# Altium schematic sheet TMS320F28335_DSP.SchDoc
size C
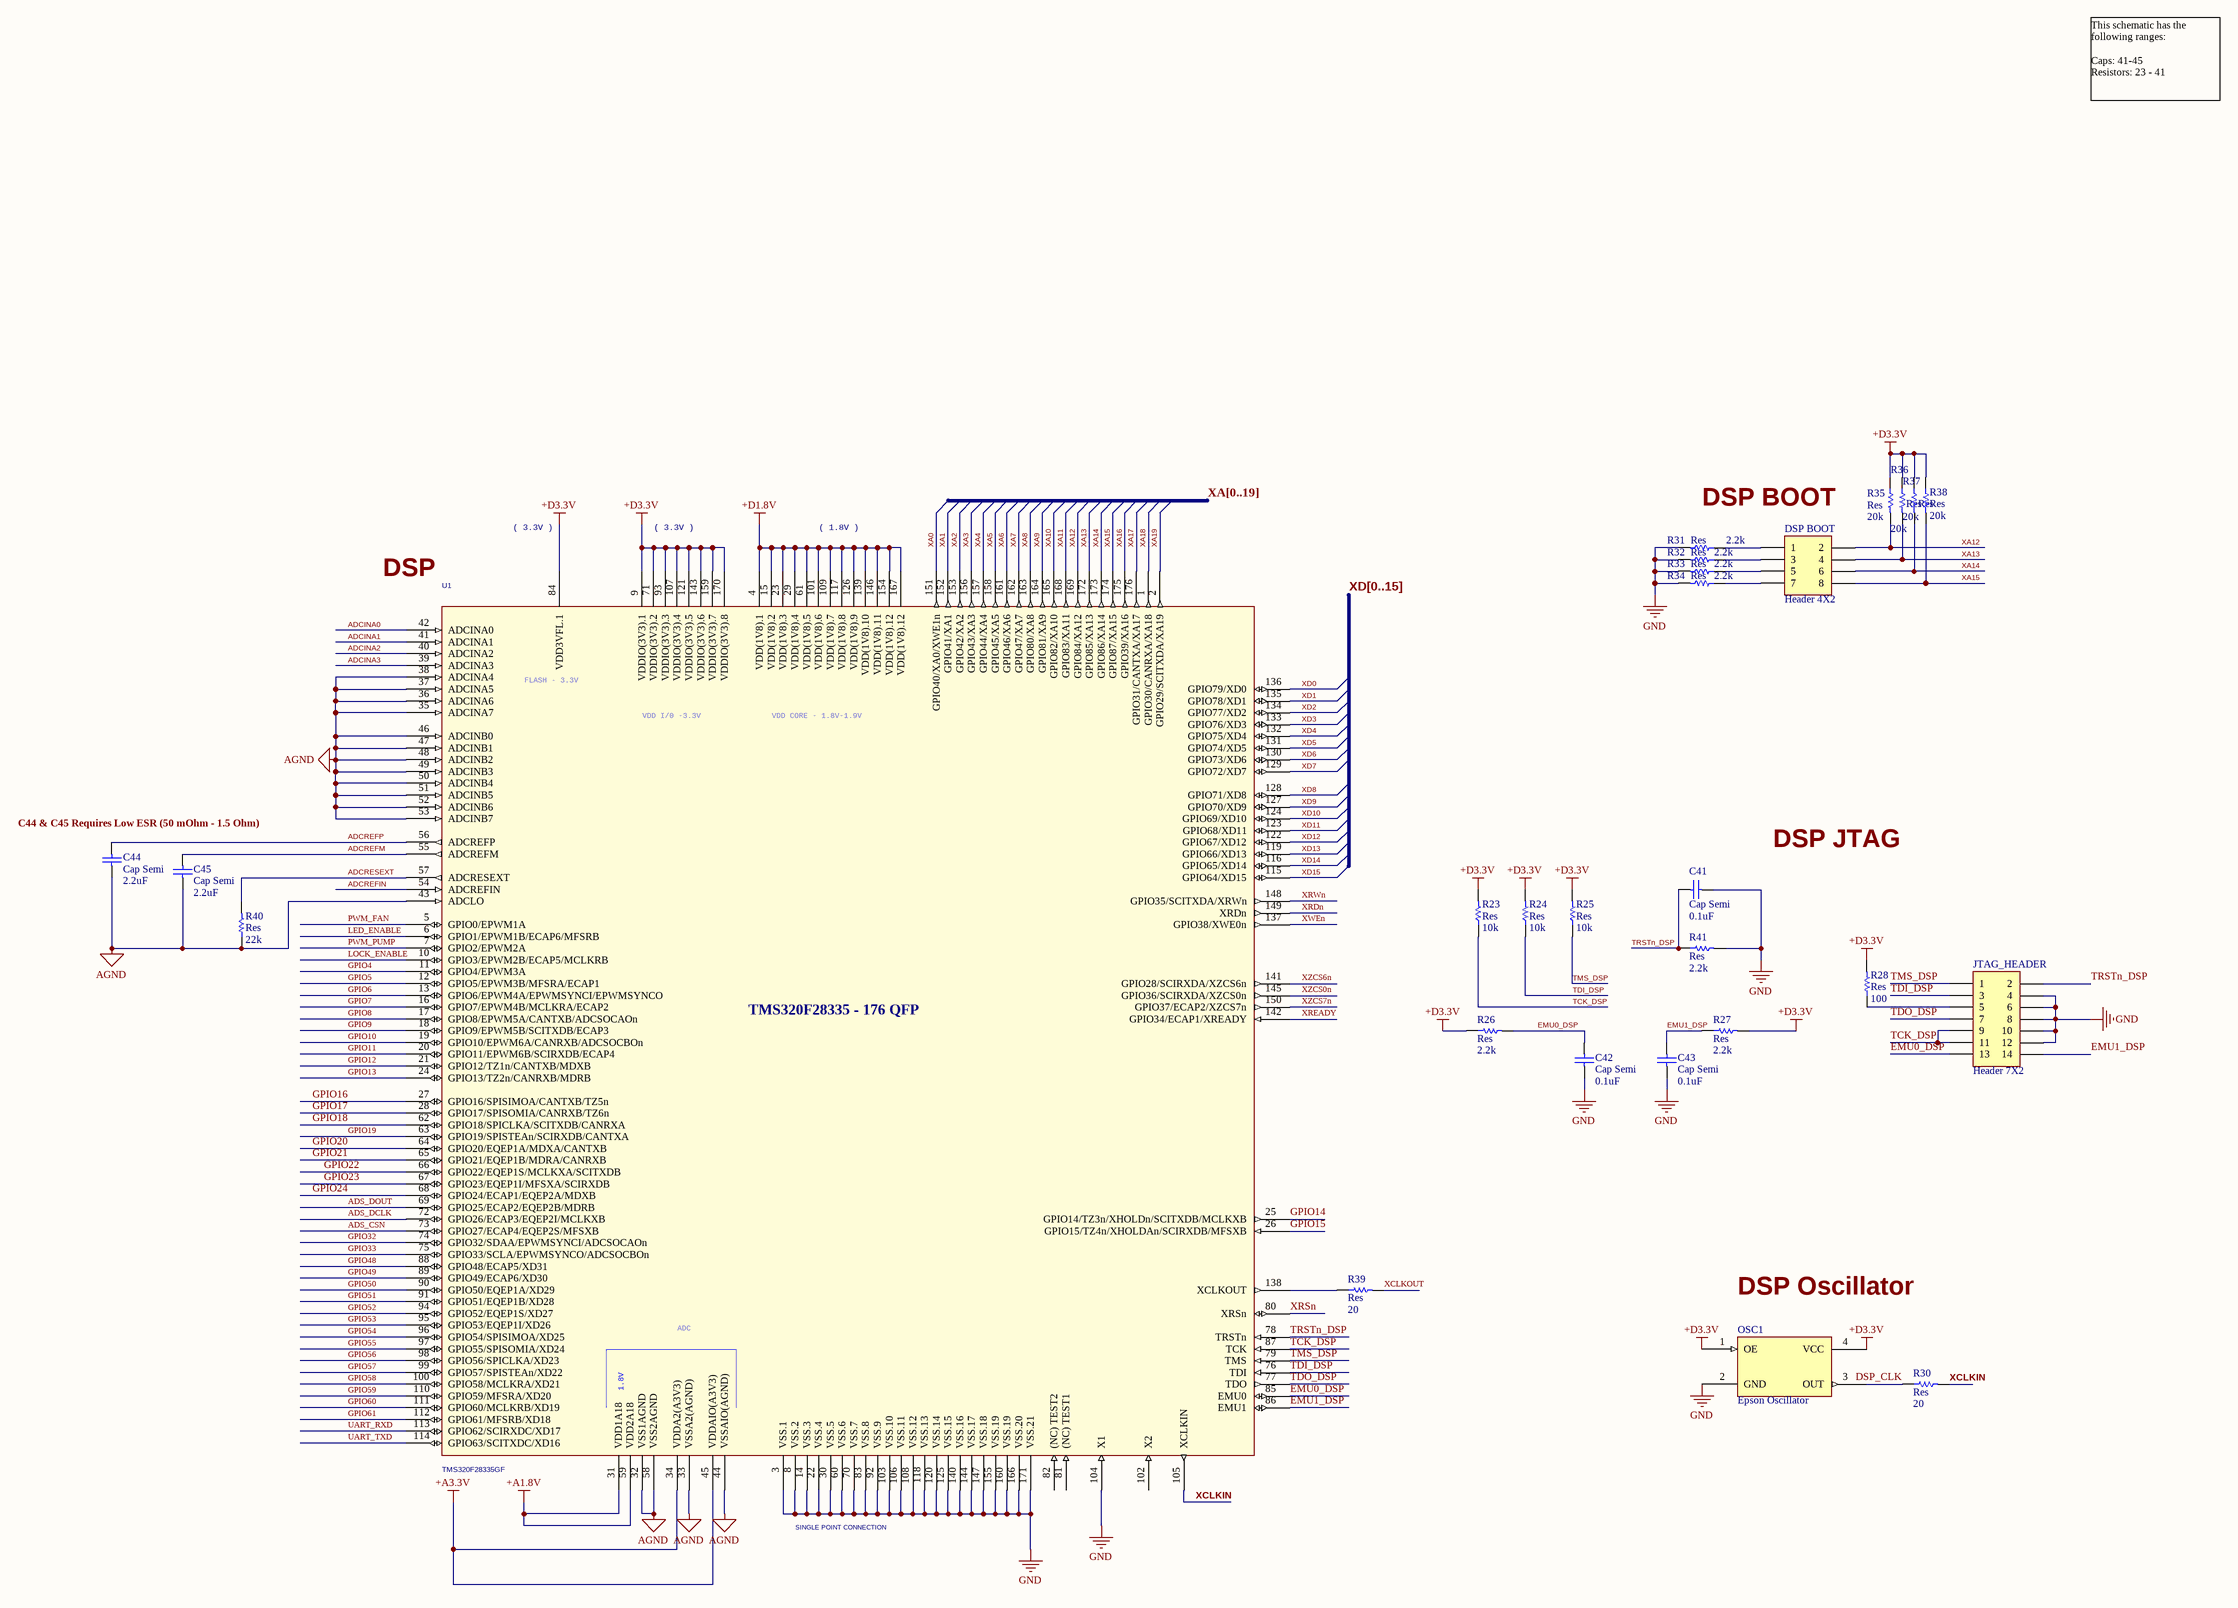
[diagram p0: TMS320F28335_DSP.SchDoc]

## Parts
C41  Cap Semi  value 0.1uF  [0805]
C42  Cap Semi  value 0.1uF  [0805]
C43  Cap Semi  value 0.1uF  [0805]
C44  Cap Semi  value 2.2uF  [0805]
C45  Cap Semi  value 2.2uF  [0805]
DSP_BOOT  Header 4X2  [HDR2X4]
JTAG_HEADER  Header 7X2  [HDR2X7]
OSC1  Epson Oscillator  [Oscillator]
R23  Res  value 10k  [0805]
R24  Res  value 10k  [0805]
R25  Res  value 10k  [0805]
R26  Res  value 2.2k  [0805]
R27  Res  value 2.2k  [0805]
R28  Res  value 100  [0805]
R30  Res  value 20  [0805]
R31  Res  value 2.2k  [0805]
R32  Res  value 2.2k  [0805]
R33  Res  value 2.2k  [0805]
R34  Res  value 2.2k  [0805]
R35  Res  value 20k  [0805]
R36  Res  value 20k  [0805]
R37  Res  value 20k  [0805]
R38  Res  value 20k  [0805]
R39  Res  value 20  [0805]
R40  Res  value 22k  [0805]
R41  Res  value 2.2k  [0805]
U1  TMS320F28335GF  [QFP176]

## Nets
+A1.8V: U1.31(VDD1A18) U1.59(VDD2A18)
+A3.3V: U1.34(VDDA2(A3V3)) U1.45(VDDAIO(A3V3))
+D1.8V: U1.4(VDD(1V8).1) U1.15(VDD(1V8).2) U1.23(VDD(1V8).3) U1.29(VDD(1V8).4) U1.61(VDD(1V8).5) U1.101(VDD(1V8).6) U1.109(VDD(1V8).7) U1.117(VDD(1V8).8) U1.126(VDD(1V8).9) U1.139(VDD(1V8).10) U1.146(VDD(1V8).11) U1.154(VDD(1V8).12) U1.167(VDD(1V8).12)
+D3.3V: OSC1.1(OE) OSC1.4(VCC) R23.2 R24.2 R25.2 R26.1 R27.2 R28.2 R35.1 R36.1 R37.1 R38.1 U1.9(VDDIO(3V3).1) U1.71(VDDIO(3V3).2) U1.84(VDD3VFL.1) U1.93(VDDIO(3V3).3) U1.107(VDDIO(3V3).4) U1.121(VDDIO(3V3).5) U1.143(VDDIO(3V3).6) U1.159(VDDIO(3V3).7) U1.170(VDDIO(3V3).8)
AGND: C44.2 C45.2 R40.1 U1.32(VSS1AGND) U1.33(VSSA2(AGND)) U1.35(ADCINA7) U1.36(ADCINA6) U1.37(ADCINA5) U1.38(ADCINA4) U1.43(ADCLO) U1.44(VSSAIO(AGND)) U1.46(ADCINB0) U1.47(ADCINB1) U1.48(ADCINB2) U1.49(ADCINB3) U1.50(ADCINB4) U1.51(ADCINB5) U1.52(ADCINB6) U1.53(ADCINB7) U1.58(VSS2AGND)
GND: C41.1 C42.1 C43.1 JTAG_HEADER.4 JTAG_HEADER.6 JTAG_HEADER.8 JTAG_HEADER.10 JTAG_HEADER.12 OSC1.2(GND) R31.2 R32.2 R33.2 R34.2 R41.2 U1.3(VSS.1) U1.8(VSS.2) U1.14(VSS.3) U1.22(VSS.4) U1.30(VSS.5) U1.60(VSS.6) U1.70(VSS.7) U1.83(VSS.8) U1.92(VSS.9) U1.103(VSS.10) U1.104(X1) U1.106(VSS.11) U1.108(VSS.12) U1.118(VSS.13) U1.120(VSS.14) U1.125(VSS.15) U1.140(VSS.16) U1.144(VSS.17) U1.147(VSS.18) U1.155(VSS.19) U1.160(VSS.19) U1.166(VSS.20) U1.171(VSS.21)
ADCINA0: U1.42(ADCINA0)
ADCINA1: U1.41(ADCINA1)
ADCINA2: U1.40(ADCINA2)
ADCINA3: U1.39(ADCINA3)
ADCREFIN: U1.54(ADCREFIN)
ADCREFM: C45.1 U1.55(ADCREFM)
ADCREFP: C44.1 U1.56(ADCREFP)
ADCRESEXT: R40.2 U1.57(ADCRESEXT)
ADS_CSN: U1.73(GPIO27/ECAP4/EQEP2S/MFSXB)
ADS_DCLK: U1.72(GPIO26/ECAP3/EQEP2I/MCLKXB)
ADS_DOUT: U1.69(GPIO25/ECAP2/EQEP2B/MDRB)
EMU0_DSP: C42.2 JTAG_HEADER.13 R26.2 U1.85(EMU0)
EMU1_DSP: C43.2 JTAG_HEADER.14 R27.1 U1.86(EMU1)
GPIO4: U1.11(GPIO4/EPWM3A)
GPIO5: U1.12(GPIO5/EPWM3B/MFSRA/ECAP1)
GPIO6: U1.13(GPIO6/EPWM4A/EPWMSYNCI/EPWMSYNCO)
GPIO7: U1.16(GPIO7/EPWM4B/MCLKRA/ECAP2)
GPIO8: U1.17(GPIO8/EPWM5A/CANTXB/ADCSOCAOn)
GPIO9: U1.18(GPIO9/EPWM5B/SCITXDB/ECAP3)
GPIO10: U1.19(GPIO10/EPWM6A/CANRXB/ADCSOCBOn)
GPIO11: U1.20(GPIO11/EPWM6B/SCIRXDB/ECAP4)
GPIO12: U1.21(GPIO12/TZ1n/CANTXB/MDXB)
GPIO13: U1.24(GPIO13/TZ2n/CANRXB/MDRB)
GPIO14: U1.25(GPIO14/TZ3n/XHOLDn/SCITXDB/MCLKXB)
GPIO15: U1.26(GPIO15/TZ4n/XHOLDAn/SCIRXDB/MFSXB)
GPIO16: U1.27(GPIO16/SPISIMOA/CANTXB/TZ5n)
GPIO17: U1.28(GPIO17/SPISOMIA/CANRXB/TZ6n)
GPIO18: U1.62(GPIO18/SPICLKA/SCITXDB/CANRXA)
GPIO19: U1.63(GPIO19/SPISTEAn/SCIRXDB/CANTXA)
GPIO20: U1.64(GPIO20/EQEP1A/MDXA/CANTXB)
GPIO21: U1.65(GPIO21/EQEP1B/MDRA/CANRXB)
GPIO22: U1.66(GPIO22/EQEP1S/MCLKXA/SCITXDB)
GPIO23: U1.67(GPIO23/EQEP1I/MFSXA/SCIRXDB)
GPIO24: U1.68(GPIO24/ECAP1/EQEP2A/MDXB)
GPIO32: U1.74(GPIO32/SDAA/EPWMSYNCI/ADCSOCAOn)
GPIO33: U1.75(GPIO33/SCLA/EPWMSYNCO/ADCSOCBOn)
GPIO48: U1.88(GPIO48/ECAP5/XD31)
GPIO49: U1.89(GPIO49/ECAP6/XD30)
GPIO50: U1.90(GPIO50/EQEP1A/XD29)
GPIO51: U1.91(GPIO51/EQEP1B/XD28)
GPIO52: U1.94(GPIO52/EQEP1S/XD27)
GPIO53: U1.95(GPIO53/EQEP1I/XD26)
GPIO54: U1.96(GPIO54/SPISIMOA/XD25)
GPIO55: U1.97(GPIO55/SPISOMIA/XD24)
GPIO56: U1.98(GPIO56/SPICLKA/XD23)
GPIO57: U1.99(GPIO57/SPISTEAn/XD22)
GPIO58: U1.100(GPIO58/MCLKRA/XD21)
GPIO59: U1.110(GPIO59/MFSRA/XD20)
GPIO60: U1.111(GPIO60/MCLKRB/XD19)
GPIO61: U1.112(GPIO61/MFSRB/XD18)
LED_ENABLE: U1.6(GPIO1/EPWM1B/ECAP6/MFSRB)
LOCK_ENABLE: U1.10(GPIO3/EPWM2B/ECAP5/MCLKRB)
PWM_FAN: U1.5(GPIO0/EPWM1A)
PWM_PUMP: U1.7(GPIO2/EPWM2A)
TCK_DSP: JTAG_HEADER.9 JTAG_HEADER.11 R23.1 U1.87(TCK)
TDI_DSP: JTAG_HEADER.3 R24.1 U1.76(TDI)
TDO_DSP: JTAG_HEADER.7 U1.77(TDO)
TMS_DSP: JTAG_HEADER.1 R25.1 U1.79(TMS)
TRSTn_DSP: C41.2 JTAG_HEADER.2 R41.1 U1.78(TRSTn)
UART_RXD: U1.113(GPIO62/SCIRXDC/XD17)
UART_TXD: U1.114(GPIO63/SCITXDC/XD16)
XA0: U1.151(GPIO40/XA0/XWE1n)
XA1: U1.152(GPIO41/XA1)
XA2: U1.153(GPIO42/XA2)
XA3: U1.156(GPIO43/XA3)
XA4: U1.157(GPIO44/XA4)
XA5: U1.158(GPIO45/XA5)
XA6: U1.161(GPIO46/XA6)
XA7: U1.162(GPIO47/XA7)
XA8: U1.163(GPIO80/XA8)
XA9: U1.164(GPIO81/XA9)
XA10: U1.165(GPIO82/XA10)
XA11: U1.168(GPIO83/XA11)
XA12: DSP_BOOT.2 R35.2 U1.169(GPIO84/XA12)
XA13: DSP_BOOT.4 R36.2 U1.172(GPIO85/XA13)
XA14: DSP_BOOT.6 R37.2 U1.173(GPIO86/XA14)
XA15: DSP_BOOT.8 R38.2 U1.174(GPIO87/XA15)
XA16: U1.175(GPIO39/XA16)
XA17: U1.176(GPIO31/CANTXA/XA17)
XA18: U1.1(GPIO30/CANRXA/XA18)
XA19: U1.2(GPIO29/SCITXDA/XA19)
XCLKIN: R30.2 U1.105(XCLKIN)
XCLKOUT: R39.2
XD0: U1.136(GPIO79/XD0)
XD1: U1.135(GPIO78/XD1)
XD2: U1.134(GPIO77/XD2)
XD3: U1.133(GPIO76/XD3)
XD4: U1.132(GPIO75/XD4)
XD5: U1.131(GPIO74/XD5)
XD6: U1.130(GPIO73/XD6)
XD7: U1.129(GPIO72/XD7)
XD8: U1.128(GPIO71/XD8)
XD9: U1.127(GPIO70/XD9)
XD10: U1.124(GPIO69/XD10)
XD11: U1.123(GPIO68/XD11)
XD12: U1.122(GPIO67/XD12)
XD13: U1.119(GPIO66/XD13)
XD14: U1.116(GPIO65/XD14)
XD15: U1.115(GPIO64/XD15)
XRDn: U1.149(XRDn)
XREADY: U1.142(GPIO34/ECAP1/XREADY)
XRSn: U1.80(XRSn)
XRWn: U1.148(GPIO35/SCITXDA/XRWn)
XWEn: U1.137(GPIO38/XWE0n)
XZCS0n: U1.145(GPIO36/SCIRXDA/XZCS0n)
XZCS6n: U1.141(GPIO28/SCIRXDA/XZCS6n)
XZCS7n: U1.150(GPIO37/ECAP2/XZCS7n)
NetDSP_BOOT_1: DSP_BOOT.1 R31.1
NetDSP_BOOT_3: DSP_BOOT.3 R32.1
NetDSP_BOOT_5: DSP_BOOT.5 R33.1
NetDSP_BOOT_7: DSP_BOOT.7 R34.1
NetJTAG_HEADER_5: JTAG_HEADER.5 R28.1
NetOSC1_3: OSC1.3(OUT) R30.1
NetR39_1: R39.1 U1.138(XCLKOUT)

Not connected (* = marked no-connect by the designer): U1 81((NC)_TEST1) 82((NC)_TEST2) 102(X2)

## Buses and harness runs
bus XA[0..19]
bus XD[0..15]

## Notes on the sheet
- This schematic has the following ranges:
  Caps: 41-45
  Resistors: 23 - 41
- ( 3.3V )
- ( 1.8V )
- DSP BOOT
- (near U1) DSP
- C44 & C45 Requires Low ESR (50 mOhm - 1.5 Ohm)
- DSP JTAG
- DSP Oscillator
- SINGLE POINT CONNECTION
- Labels drawn without touching a wire or pin: DSP_CLK
- (in symbol TMS320F283XXPGF_23) FLASH - 3.3V; VDD I/0 -3.3V; VDD CORE - 1.8V-1.9V; TMS320F28335 - 176 QFP; ADC; 1.8V

## Library data of the parts
C41-C45 = Cap Semi: Capacitor (Semiconductor SIM Model); Published: 8-Jun-2000; LatestRevisionDate: 17-Jul-2002; LatestRevisionNote: Re-released for DXP Platform.; PackageReference: C1206; Publisher: Altium Limited
DSP_BOOT = Header 4X2: Header, 4-Pin, Dual row; LatestRevisionDate: 17-Jul-2002; LatestRevisionNote: Re-released for DXP Platform.; Publisher: Altium Limited
JTAG_HEADER = Header 7X2: Header, 7-Pin, Dual row; LatestRevisionDate: 17-Jul-2002; LatestRevisionNote: Re-released for DXP Platform.; Publisher: Altium Limited
OSC1 = Oscillator: 15Mhz Epson Clock; Digikey #: SE2826CT-ND
R23-R28 R30-R41 = Res Semi: Semiconductor Resistor; Published: 8-Jun-2000; LatestRevisionDate: 17-Jul-2002; LatestRevisionNote: Re-released for DXP Platform.; PackageReference: AXIAL-0.5; Publisher: Altium Limited
U1 = TMS320F283XXPGF_23: Texas Instruments F28335; Digikey #: 296-23660-ND